# Altium project BachelorPRJCT2.PrjPcb
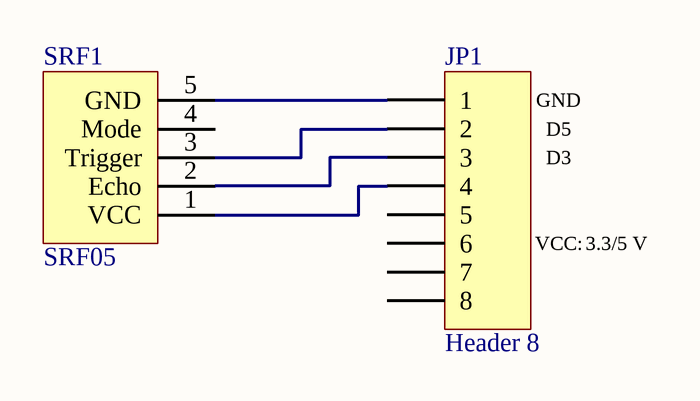
[diagram p0: PRJCTSheet.SchDoc]
1 sheet, 2 parts. Net scope: global (net labels, ports and power ports of the same name join across sheets).
Board file: PRJCTPCB2.PcbDoc

## Sheet PRJCTSheet.SchDoc
size A; SheetNumber: 1; SheetTotal: 1

### Parts
JP1  Header 8  [HDR1X8]
SRF1  SRF05  [SRF05]

### Nets
NetJP1_1: JP1.1 SRF1.5(GND)
NetJP1_2: JP1.2 SRF1.3(Trigger)
NetJP1_3: JP1.3 SRF1.2(Echo)
NetJP1_4: JP1.4 SRF1.1(VCC)

Not connected (* = marked no-connect by the designer): JP1 5 6 7 8; SRF1 4(Mode)

### Notes on the sheet
- (near JP1) GND
- (near JP1) D5
- (near JP1) D3
- (near JP1) VCC:
- 3.3/5 V

### Library data of the parts
JP1 = Header 8: Header, 8-Pin; Revision: 17-Jul-2002: Re-released for DXP Platform.; Publisher: Altium Limited
SRF1 = SRF05: SRF05 - Ultra-Sonic Ranger; Designer: Seyed Mohsen ghasemian; WEB: www.picpars.com